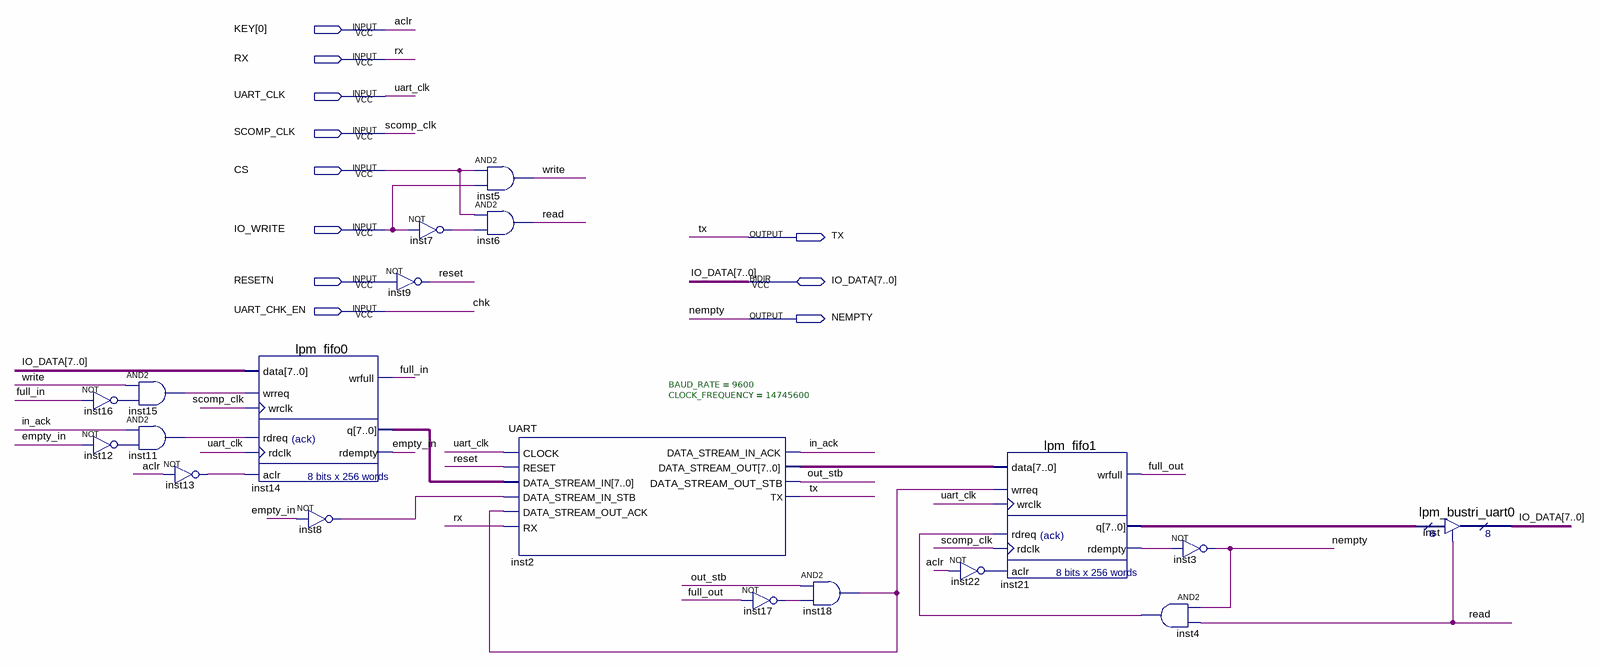
[diagram p0: schematic sheet]
// Quartus schematic UART_INTERFACE.bdf as structural Verilog: 19 symbols, 11 pins
module UART_INTERFACE (
  input  [0:0] KEY,
  input  RX,
  input  UART_CLK,
  input  SCOMP_CLK,
  input  CS,
  input  IO_WRITE,
  input  RESETN,
  input  UART_CHK_EN,
  inout  [7:0] IO_DATA,
  output TX,
  output NEMPTY
);

  wire empty_in, full_in, full_out, in_ack, inst4_out, inst7_out, inst8_out, inst11_out, inst12_out,
       inst13_out, inst15_out, inst16_out, inst17_out, inst18_out, inst21_rdempty, inst22_out, out_stb, read,
       reset, write;
  wire [7:0] inst2_data_stream_out, inst14_q, inst21_q;

  and inst15 (inst15_out, write, inst16_out);
  not inst16 (inst16_out, full_in);
  and inst11 (inst11_out, in_ack, inst12_out);
  not inst12 (inst12_out, empty_in);
  not inst13 (inst13_out, KEY[0]);
  lpm_fifo0 inst14 (
    .data(IO_DATA), .wrreq(inst15_out), .wrclk(SCOMP_CLK), .rdreq(inst11_out), .rdclk(UART_CLK),
    .aclr(inst13_out), .wrfull(full_in), .q(inst14_q), .rdempty(empty_in));
  not inst8 (inst8_out, empty_in);
  not inst7 (inst7_out, IO_WRITE);
  not inst9 (reset, RESETN);
  and inst5 (write, CS, IO_WRITE);
  and inst6 (read, CS, inst7_out);
  UART #(.BAUD_RATE(9600), .CLOCK_FREQUENCY(14745600)) inst2 (
    .CLOCK(UART_CLK), .RESET(reset), .DATA_STREAM_IN(inst14_q), .DATA_STREAM_IN_STB(inst8_out),
    .DATA_STREAM_OUT_ACK(inst18_out), .RX(RX), .DATA_STREAM_IN_ACK(in_ack),
    .DATA_STREAM_OUT(inst2_data_stream_out), .DATA_STREAM_OUT_STB(out_stb), .TX(TX));
  not inst17 (inst17_out, full_out);
  and inst18 (inst18_out, out_stb, inst17_out);
  not inst22 (inst22_out, KEY[0]);
  lpm_fifo1 inst21 (
    .data(inst2_data_stream_out), .wrreq(inst18_out), .wrclk(UART_CLK), .rdreq(inst4_out), .rdclk(SCOMP_CLK),
    .aclr(inst22_out), .wrfull(full_out), .q(inst21_q), .rdempty(inst21_rdempty));
  not inst3 (NEMPTY, inst21_rdempty);
  and inst4 (inst4_out, NEMPTY, read);
  lpm_bustri_uart0 inst (.enabledt(read), .data(inst21_q), .tridata(IO_DATA));

  // Other names for the same wires on the sheet: aclr = KEY[0]; chk = UART_CHK_EN
endmodule
